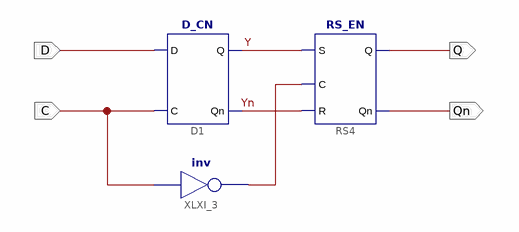
[diagram p0: schematic sheet 1]
// Xilinx ISE schematic D_Trig.sch (spartan3) as structural Verilog: 3 symbols, 4 ports
module D_Trig (
  input  D,
  input  C,
  output Q,
  output Qn
);

  wire XLXN_6, Y, Yn;

  RS_EN RS4 (.Q(Q), .Qn(Qn), .C(XLXN_6), .S(Y), .R(Yn));
  not XLXI_3 (XLXN_6, C);
  D_CN D1 (.Q(Y), .Qn(Yn), .D(D), .C(C));
endmodule
